# EAGLE design hat2 (EAGLE 7.6.0)
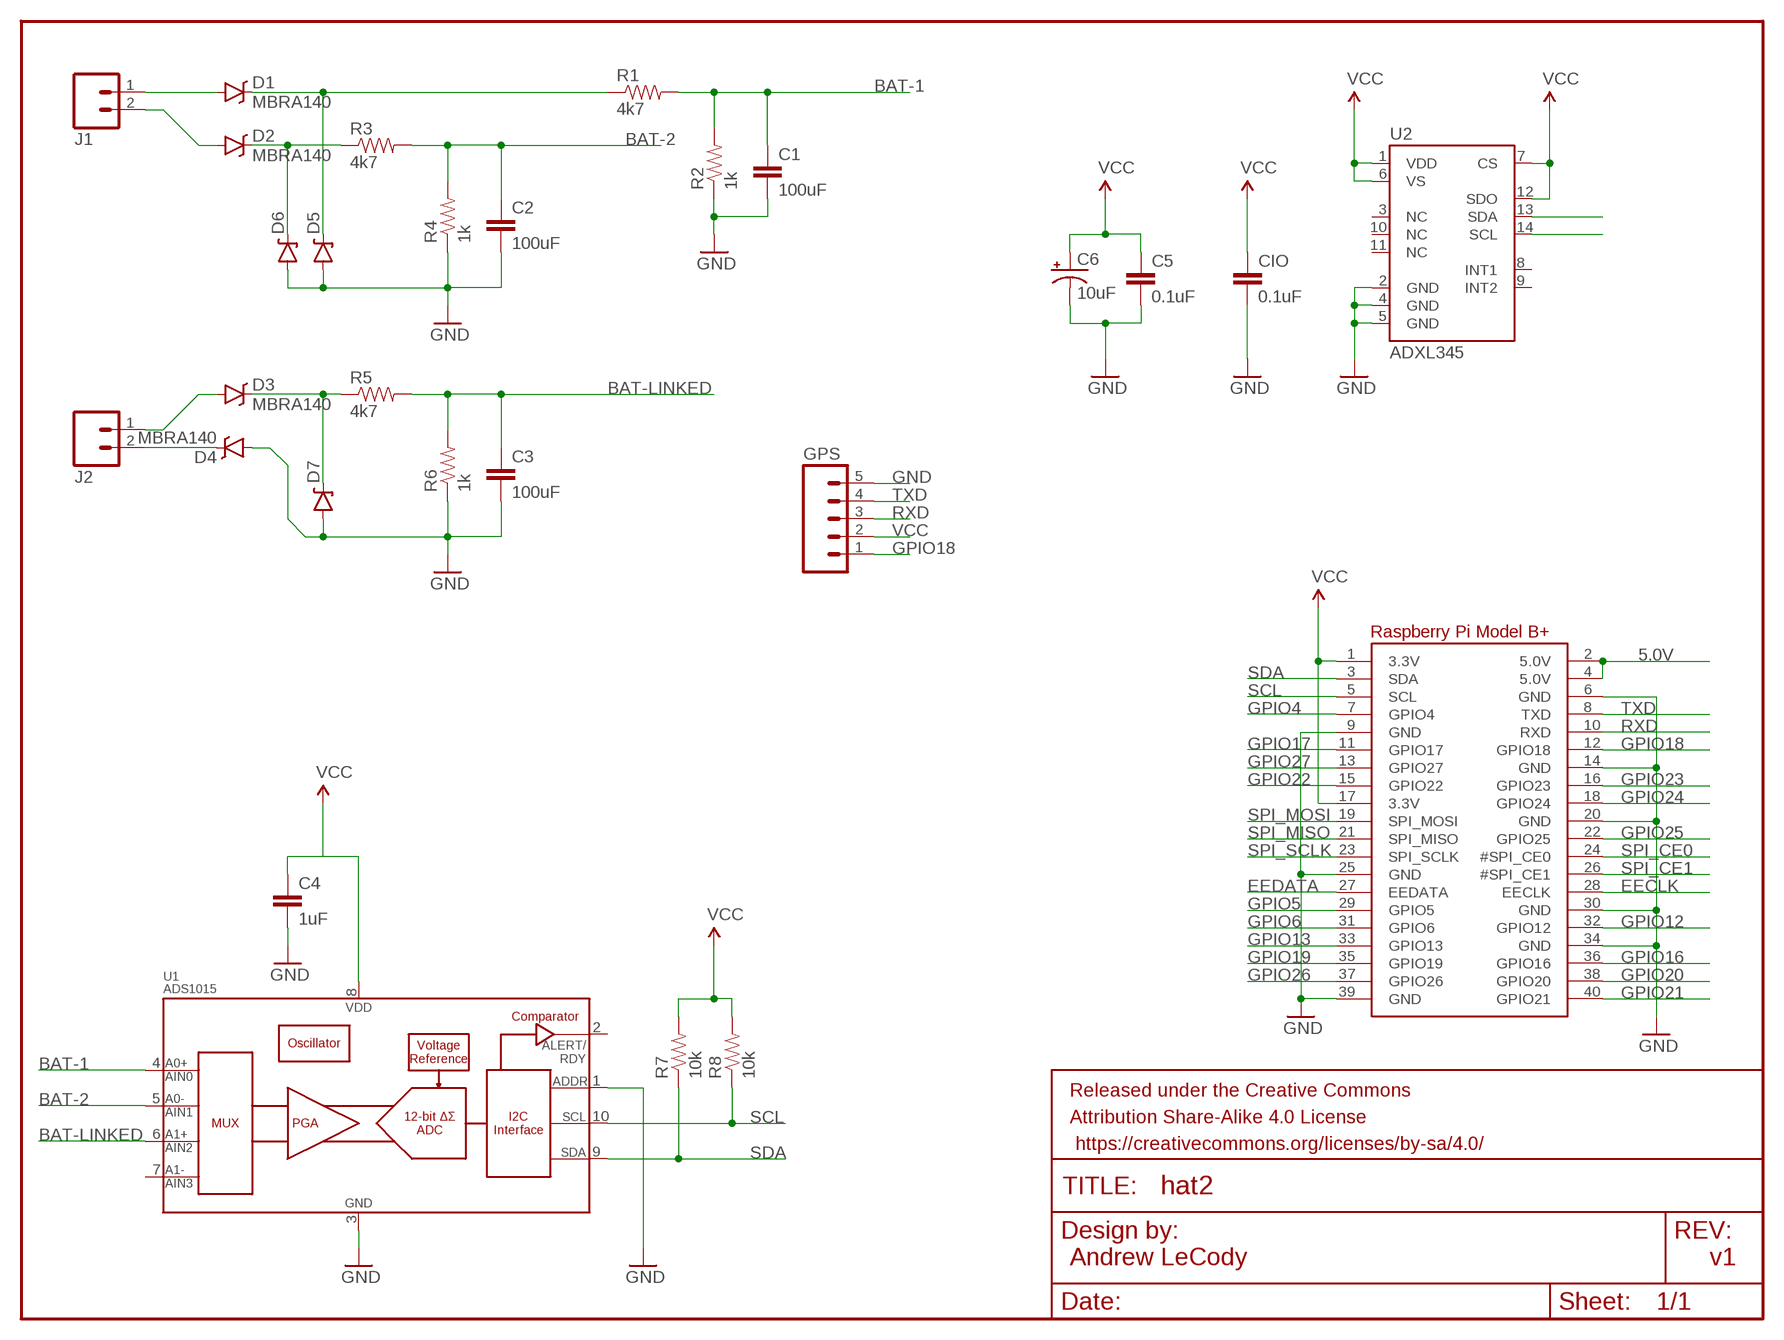
[diagram p0: schematic, sheet 1]

## Parts
C1  100uF  CAP0603-CAP  [0603-CAP]
C2  100uF  CAP0603-CAP  [0603-CAP]
C3  100uF  CAP0603-CAP  [0603-CAP]
C4  1uF  CAP0603-CAP  [0603-CAP]
C5  0.1uF  CAP0603-CAP  [0603-CAP]
C6  10uF  CAP_POL1206  [EIA3216]
CIO  0.1uF  CAP0603-CAP  [0603-CAP]
D1  MBRA140  DIODE-SCHOTTKY-MBRA140  [SMA-DIODE]
D2  MBRA140  DIODE-SCHOTTKY-MBRA140  [SMA-DIODE]
D3  MBRA140  DIODE-SCHOTTKY-MBRA140  [SMA-DIODE]
D4  MBRA140  DIODE-SCHOTTKY-MBRA140  [SMA-DIODE]
D5  DIODE-ZENERSMB  [SMB-DIODE]
D6  DIODE-ZENERSMB  [SMB-DIODE]
D7  DIODE-ZENERSMB  [SMB-DIODE]
FRAME1  FRAME-LETTER  [CREATIVE_COMMONS]
GPS  M05PTH  [1X05]
J1  M025MM  [SCREWTERMINAL-5MM-2]
J2  M025MM  [SCREWTERMINAL-5MM-2]
R1  4k7  RESISTOR0603-RES  [0603-RES]
R2  1k  RESISTOR0603-RES  [0603-RES]
R3  4k7  RESISTOR0603-RES  [0603-RES]
R4  1k  RESISTOR0603-RES  [0603-RES]
R5  4k7  RESISTOR0603-RES  [0603-RES]
R6  1k  RESISTOR0603-RES  [0603-RES]
R7  10k  RESISTOR0603-RES  [0603-RES]
R8  10k  RESISTOR0603-RES  [0603-RES]
RPI1  RASPBERRYPI_BPLUS_HATNOSLOTS  [PI_HAT_NOSLOTS]
U1  ADS1015  [MSOP10]
U2  ADXL345  [LGA14]

## Nets
5.0V: RPI1.2(5.0V) RPI1.4(5.0V)
BAT-1: C1.1 R1.2 R2.2 U1.4(AIN0)
BAT-2: C2.1 R3.2 R4.2 U1.5(AIN1)
BAT-LINKED: C3.1 R5.2 R6.2 U1.6(AIN2)
EECLK: RPI1.28(EECLK)
EEDATA: RPI1.27(EEDATA)
GND: C1.2 C2.2 C3.2 C4.2 C5.2 C6.C(-) CIO.2 D4.A D5.A D6.A D7.A GPS.5 R2.1 R4.1 R6.1 RPI1.6(GND) RPI1.9(GND) RPI1.14(GND) RPI1.20(GND) RPI1.25(GND) RPI1.30(GND) RPI1.34(GND) RPI1.39(GND) U1.1(ADDR) U1.3(VSS) U2.2(GND) U2.4(GND) U2.5(GND)
GPIO4: RPI1.7(GPIO4)
GPIO5: RPI1.29(GPIO5)
GPIO6: RPI1.31(GPIO6)
GPIO12: RPI1.32(GPIO12)
GPIO13: RPI1.33(GPIO13)
GPIO16: RPI1.36(GPIO16)
GPIO17: RPI1.11(GPIO17)
GPIO18: GPS.1 RPI1.12(GPIO18)
GPIO19: RPI1.35(GPIO19)
GPIO20: RPI1.38(GPIO20)
GPIO21: RPI1.40(GPIO21)
GPIO22: RPI1.15(GPIO22)
GPIO23: RPI1.16(GPIO23)
GPIO24: RPI1.18(GPIO24)
GPIO25: RPI1.22(GPIO25)
GPIO26: RPI1.37(GPIO26)
GPIO27: RPI1.13(GPIO27)
N$1: D1.A J1.1
N$2: D2.A J1.2
N$3: D3.A J2.1
N$4: D4.C J2.2
N$5: D1.C D5.C R1.1
N$7: D2.C D6.C R3.1
N$9: D3.C D7.C R5.1
RXD: GPS.3 RPI1.10(RXD)
SCL: R8.1 RPI1.5(SCL) U1.10(SCL) U2.14(SCL)
SDA: R7.1 RPI1.3(SDA) U1.9(SDA) U2.13(SDA)
SPI_CE0: RPI1.24(#SPI_CE0)
SPI_CE1: RPI1.26(#SPI_CE1)
SPI_MISO: RPI1.21(SPI_MISO)
SPI_MOSI: RPI1.19(SPI_MOSI)
SPI_SCLK: RPI1.23(SPI_SCLK)
TXD: GPS.4 RPI1.8(TXD)
VCC: C4.1 C5.1 C6.A(+) CIO.1 GPS.2 R7.2 R8.2 RPI1.1(3.3V) RPI1.17(3.3V) U1.8(VDD) U2.1(VDD) U2.6(VS) U2.7(CS) U2.12(SDO)
Unconnected: U1.2(ALERT/RDY) U1.7(AIN3) U2.3(NC) U2.8(INT1) U2.9(INT2) U2.10(NC) U2.11(NC)

## Notes on the sheet
- Andrew LeCody | v1

## Library data of the parts
C1-C4 = SparkFun-Passives:CAP: Capacitor Standard 0603 ceramic capacitor, and 0.1" leaded capacitor.
C5 CIO = SparkFun:CAP: Capacitor Standard 0603 ceramic capacitor, and 0.1" leaded capacitor.
C6 = SparkFun:CAP_POL: Capacitor Polarized These are standard SMD and PTH capacitors. Normally 10uF, 47uF, and 100uF in electrolytic and tantalum varieties. Always verify the external diameter of the through hole cap, it varies with capacity, voltage, and manufacturer. The EIA devices should be standard.
D1-D4 = SparkFun-DiscreteSemi:DIODE-SCHOTTKY: Schottky diodes in SFE's production catalog BAT20J 1A 23V 0.62Vf RB751 120mA 40V 0.37Vf PMEG4005EJ 0.5A 40V 0.42Vf MBRA140 1A 40V 0.5Vf B340A 3A 40V SMA; PROD_ID: DIO-08053
D5-D7 = SparkFun-DiscreteSemi:DIODE-ZENER: Zener Diode Production Part - 8199 3.4V Zener Voltage
FRAME1 = SparkFun-Aesthetics:FRAME-LETTER: Schematic Frame Standard 8.5x11 US Letter frame
GPS = SparkFun-Connectors:M05: Header 5 Standard 5-pin 0.1" header. Use with straight break away headers (SKU : PRT-00116), right angle break away headers (PRT-00553), swiss pins (PRT-00743), machine pins (PRT-00117), and female headers (PRT-00115). Molex polarized connector foot print use with SKU : PRT-08230 with associated crimp pins and housings.
J1 J2 = SparkFun-Connectors:M02: Standard 2-pin 0.1" header. Use with - straight break away headers ( PRT-00116) - right angle break away headers (PRT-00553) - swiss pins (PRT-00743) - machine pins (PRT-00117) - female headers (PRT-00115) Molex polarized connector foot print use with: PRT-08233 with associated crimp pins and housings. 2.54_SCREWTERM for use with PRT-10571. 3.5mm Screw Terminal footprints for PRT-08084 5mm Screw Terminal footprints for use with PRT-08432; STOREFRONT_ID: PRT-08432
R1-R8 = SparkFun-Passives:RESISTOR: Resistor Basic schematic elements and footprints for 0603, 1206, and PTH resistors.
RPI1 = microbuilder:RASPBERRYPI_BPLUS
U1 = SparkFun-AnalogIC:ADS1015: 12-Bit Del-Sig ADC Four single-ended inputs or two differential inputs Internal PGA I2C interface 2.0-5.5V; PROD_ID: IC-12239
U2 = SparkFun-Sensors:ADXL345: 3-axis SPI/I2C 2/4/8/16g accelerometer

## Board
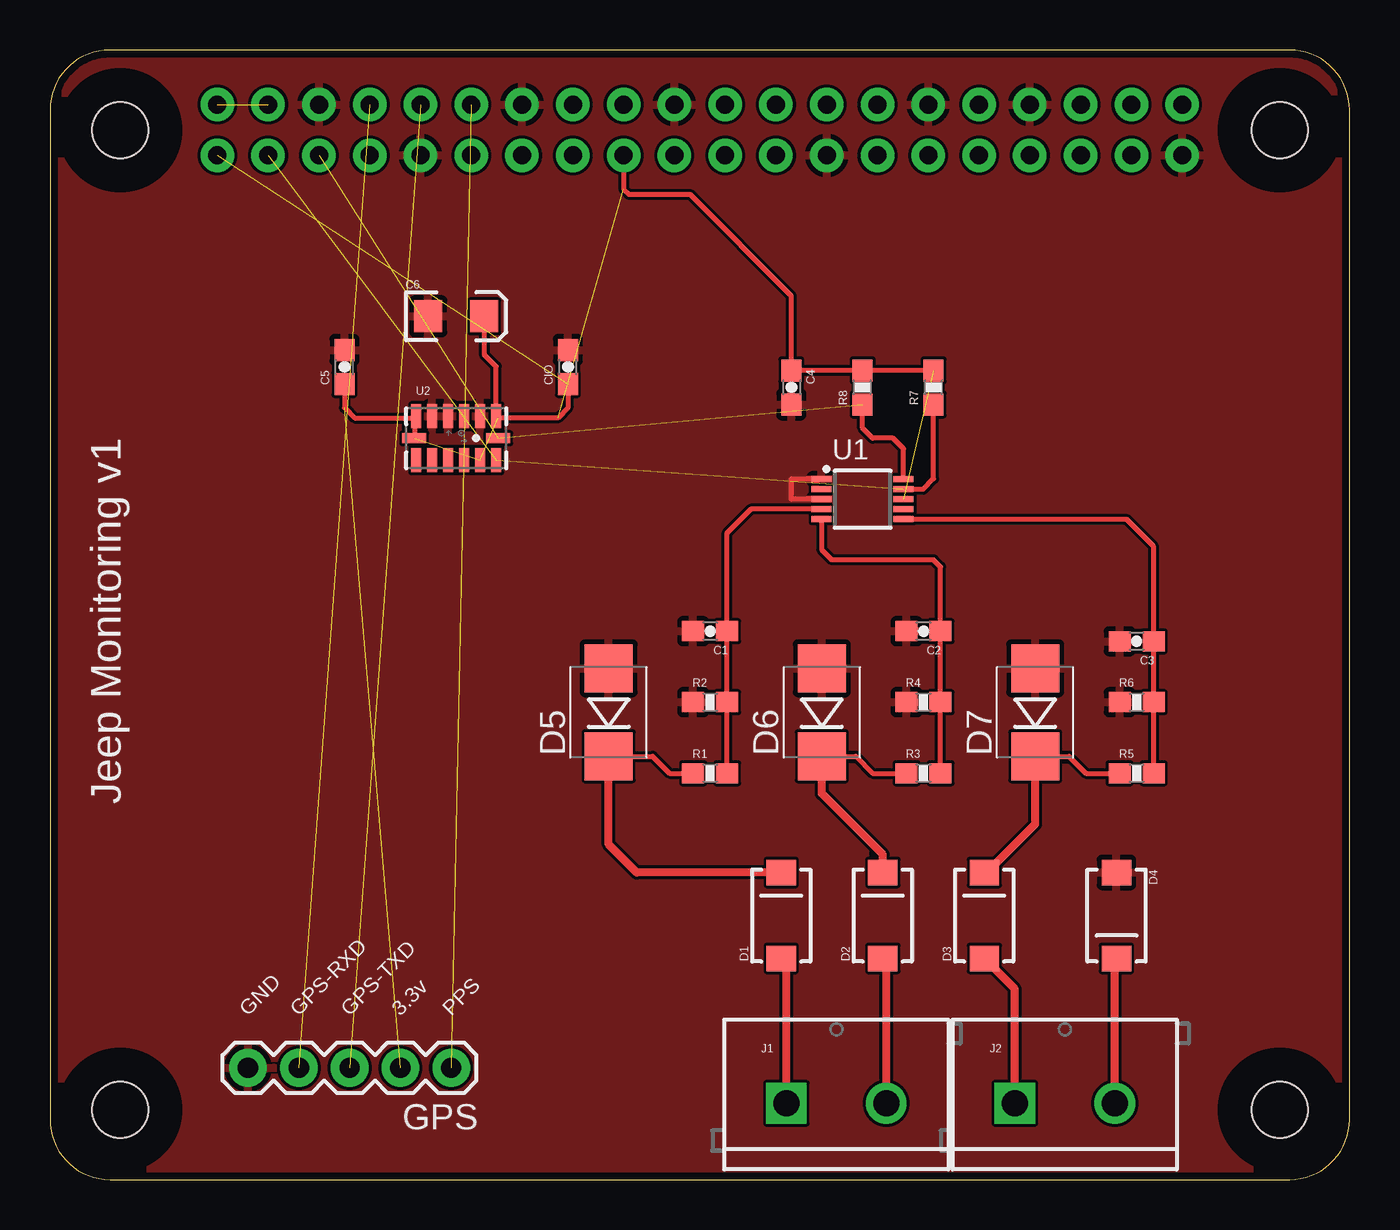
[diagram p1: board, top side]
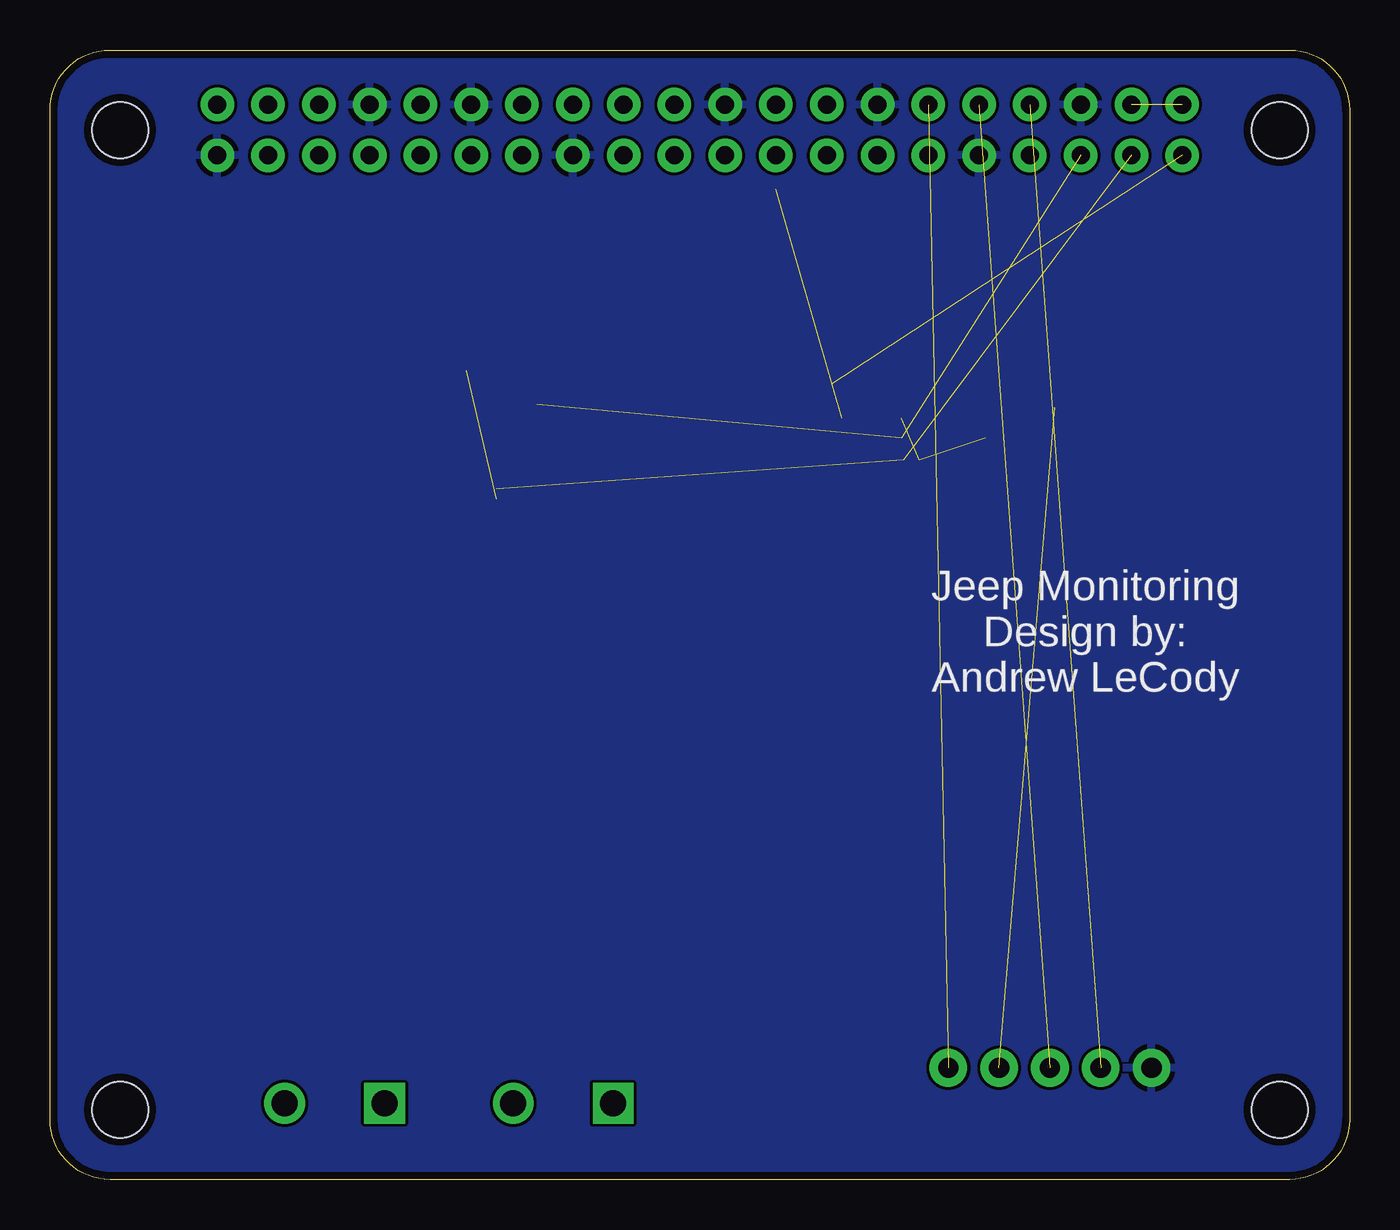
[diagram p2: board, bottom side, seen from below]

Size 65 x 56.5 mm. Coordinates in mm from the lower left corner, seen from the top.
Copper layers (1*16): Top 0.0356mm / dielectric 1.5011mm / Bottom 0.0356mm
Design rules "oshpark-2layer": minimum track width 6mil, minimum drill 13mil, track to track 6mil, track to pad 6mil, pad to pad 6mil, via to via 6mil, smd to smd 6mil, copper to edge 15mil, drill to drill 6mil, minimum pad ring 7mil, minimum via ring 7mil, stop-mask expansion 2.5mil, vias tented up to drill 0mil, thermal gap 10mil

### Footprints (pad centres in the part's own frame; a part is rotated, then mirrored left to right if it is on the bottom)
0603-CAP = smd 1.1 x 1: 1 -0.85,0; 2 0.85,0
EIA3216 = smd 1.4 x 1.6: A 1.4,0; C -1.4,0
SMA-DIODE = smd 1.27 x 1.47: A -2.15,0; C 2.15,0
SMB-DIODE = smd 2.4 x 2.4: A 2.2,0; C -2.2,0
1X05 = drill 1.016 pad 1.88: 1 0,0; 2 2.54,0; 3 5.08,0; 4 7.62,0; 5 10.16,0
SCREWTERMINAL-5MM-2 = drill 1.3 pad 2.032 square: 1 0,0 | drill 1.3 pad 2.032: 2 5,0
0603-RES = smd 1.1 x 1: 1 -0.85,0; 2 0.85,0
PI_HAT_NOSLOTS = drill 0.9 pad 1.676: 1 8.37,51.23; 2 8.37,53.77; 3 10.91,51.23; 4 10.91,53.77; 5 13.45,51.23; 6 13.45,53.77; 7 15.99,51.23; 8 15.99,53.77; 9 18.53,51.23; 10 18.53,53.77; 11 21.07,51.23; 12 21.07,53.77; 13 23.61,51.23; 14 23.61,53.77; 15 26.15,51.23; 16 26.15,53.77; 17 28.69,51.23; 18 28.69,53.77; 19 31.23,51.23; 20 31.23,53.77; 21 33.77,51.23; 22 33.77,53.77; 23 36.31,51.23; 24 36.31,53.77; 25 38.85,51.23; 26 38.85,53.77; 27 41.39,51.23; 28 41.39,53.77; 29 43.93,51.23; 30 43.93,53.77; 31 46.47,51.23; 32 46.47,53.77; 33 49.01,51.23; 34 49.01,53.77; 35 51.55,51.23; 36 51.55,53.77; 37 54.09,51.23; 38 54.09,53.77; 39 56.63,51.23; 40 56.63,53.77 | hole 2.8: 3.5,3.5; 3.5,52.5; 61.5,52.5; 61.5,3.5
MSOP10 = smd 0.3 x 1: 1 -1,-2.05; 2 -0.5,-2.05; 3 0,-2.05; 4 0.5,-2.05; 5 1,-2.05; 6 1,2.05; 7 0.5,2.05; 8 0,2.05; 9 -0.5,2.05; 10 -1,2.05
LGA14 = smd 0.5 x 1.2: 1 2,1.1; 2 1.2,1.1; 3 0.4,1.1; 4 -0.4,1.1; 5 -1.2,1.1; 6 -2,1.1; 8 -2,-1.1; 9 -1.2,-1.1; 10 -0.4,-1.1; 11 0.4,-1.1; 12 1.2,-1.1; 13 2,-1.1 | smd 1.2 x 0.5: 7 -2.1,0; 14 2.1,0

### Placement (x,y rotation side)
C1  33.02,27.43 180 top
C2  43.69,27.43 180 top
C3  54.36,26.92 180 top
C4  37.08,39.62 270 top
C5  14.73,40.64 90 top
C6  20.32,43.18 0 top
CIO  25.91,40.64 90 top
D1  36.58,13.21 90 top
D2  41.66,13.21 90 top
D3  46.74,13.21 90 top
D4  53.34,13.21 270 top
D5  27.94,23.37 90 top
D6  38.61,23.37 90 top
D7  49.28,23.37 90 top
FRAME1  2.54,-8.89 0 top  (outside the outline)
GPS  20.07,5.59 180 top
J1  36.83,3.81 0 top
J2  48.26,3.81 0 top
R1  33.02,20.32 0 top
R2  33.02,23.88 0 top
R3  43.69,20.32 0 top
R4  43.69,23.88 0 top
R5  54.36,20.32 0 top
R6  54.36,23.88 0 top
R7  44.2,39.62 90 top
R8  40.64,39.62 90 top
RPI1  0,0 0 top
U1  40.64,34.04 270 top
U2  20.32,37.08 0 top

### Tracks (layer width: path | path; a pad name or v marks a point on that pad's centre or on a via)
5.0V  (1 unrouted)
BAT-1
  Top 0.254: R1.2 R2.2 C1.1 33.87,32.35 35.06,33.54 U1.4
BAT-2
  Top 0.254: R3.2 R4.2 C2.1 44.54,30.65 44.2,30.99 39.12,30.99 38.59,31.51 U1.5
BAT-LINKED
  Top 0.254: R5.2 R6.2 C3.1 55.21,31.66 53.83,33.04 U1.6
GND
  Top 0.254: U1.3 37.08,34.04 37.08,35.05 38.57,35.05 U1.1
  pour Bottom: 66.04,-1.27 66.04,57.15 -1.27,57.15 -1.27,-1.27
  pour Top: -1.27,57.15 66.04,57.15 66.04,-1.27 -1.27,-1.27
GPIO18  (1 unrouted)
N$1
  Top 0.406: J1.1 36.83,10.8 D1.A
N$2
  Top 0.406: J1.2 41.83,10.88 D2.A
N$3
  Top 0.406: J2.1 48.26,9.53 D3.A
N$4
  Top 0.406: J2.2 53.26,10.98 D4.C
N$5
  Top 0.254: D5.C 30.14,21.17 30.99,20.32 R1.1
  Top 0.406: D1.C 29.35,15.36 27.94,16.76 D5.C
N$7
  Top 0.254: D6.C 40.3,21.17 41.15,20.32 R3.1
  Top 0.406: D2.C 41.66,16.26 38.61,19.3 D6.C
N$9
  Top 0.254: D7.C 50.97,21.17 51.82,20.32 R5.1
  Top 0.406: D3.C 46.85,15.36 49.28,17.78 D7.C
RXD  (1 unrouted)
SCL  (2 unrouted)
  Top 0.254: U1.10 42.69,36.56 42.16,37.08 41.15,37.08 40.64,37.59 R8.1
SDA  (2 unrouted)
  Top 0.254: U1.9 43.68,34.54 44.2,35.05 R7.1
TXD  (1 unrouted)
VCC  (6 unrouted)
  Top 0.254: C5.1 14.73,38.61 15.24,38.1 18.24,38.1 | 18.24,38.1 U2.6 | C6.A 21.72,41.27 22.32,40.67 U2.1 22.4,38.1 25.4,38.1 25.91,38.61 CIO.1 | 18.24,38.1 18.24,37.1 U2.7 | R7.2 R8.2 C4.1 37.08,44.2 32,49.28 28.96,49.28 28.69,49.54 RPI1.17

### Text on the board
tPlace: Jeep Monitoring v1
bPlace: Jeep Monitoring / Design by: / Andrew LeCody
tNames: GND | GPS-RXD | GPS-TXD | 3.3v | PPS
tDocu: Andrew LeCody